# EAGLE design 2019_Dashboard(rev_1-15-19) (EAGLE 9.1.3)
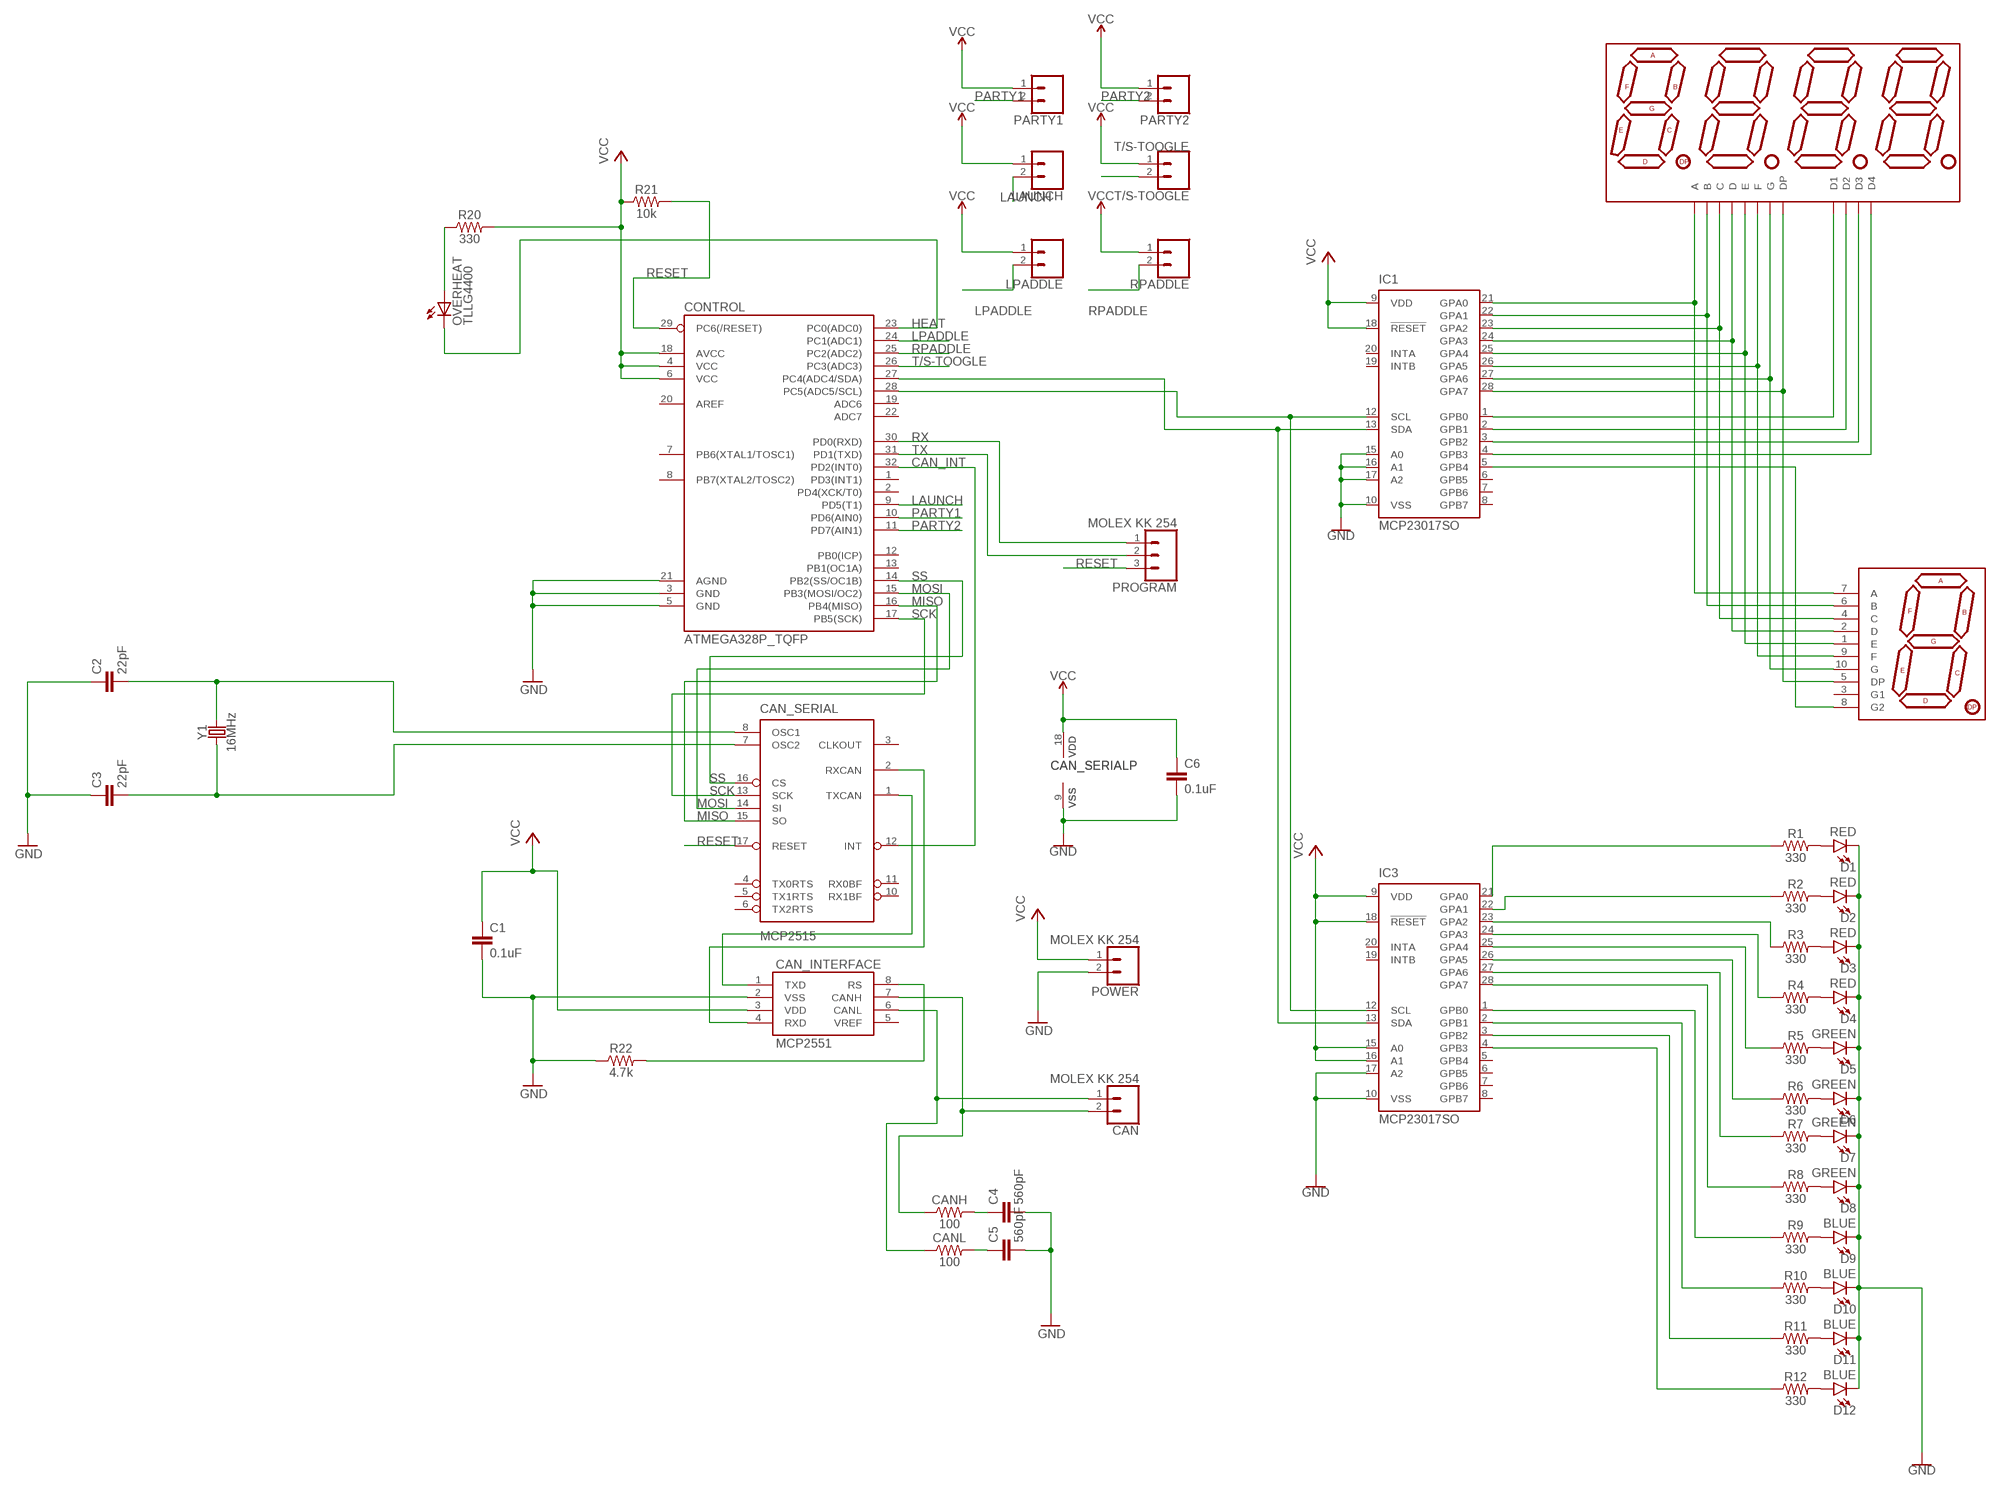
[diagram p0: schematic, sheet 1]

## Parts
C1  0.1uF  0.1UF-0603-25V-(+80/-20%)  [0603]
C2  22pF  22PF-0603-50V-5%  [0603]
C3  22pF  22PF-0603-50V-5%  [0603]
C4  560pF  560PF-0603-50V-5%  [0603]
C5  560pF  560PF-0603-50V-5%  [0603]
C6  0.1uF  0.1UF-0402-16V-10%  [0402]
CAN  MOLEX KK 254  CONN_02  [1X02]
CAN_INTERFACE  MCP2551  [SO08]
CAN_SERIAL  MCP2515  MCP2515(MCP2510)SO  [SO18W]
CANH  100  100OHM-0603-1/4W-5%  [0603]
CANL  100  100OHM-0603-1/4W-5%  [0603]
CONTROL  ATMEGA328P_TQFP  [TQFP32-08]
D1  RED  LED-RED1206  [LED-1206]
D2  RED  LED-RED1206  [LED-1206]
D3  RED  LED-RED1206  [LED-1206]
D4  RED  LED-RED1206  [LED-1206]
D5  GREEN  LED-GREENLILYPAD  [LED-1206]
D6  GREEN  LED-GREENLILYPAD  [LED-1206]
D7  GREEN  LED-GREENLILYPAD  [LED-1206]
D8  GREEN  LED-GREENLILYPAD  [LED-1206]
D9  BLUE  LED-BLUE1206  [LED-1206]
D10  BLUE  LED-BLUE1206  [LED-1206]
D11  BLUE  LED-BLUE1206  [LED-1206]
D12  BLUE  LED-BLUE1206  [LED-1206]
DISP1  ATA8041ARBJ  7-SEGMENT-4DIGIT-20MM-RED  [7-SEGMENT-4DIGIT-20MM]
IC1  MCP23017SO  [SO28W]
IC3  MCP23017SO  [SO28W]
LAUNCH  CONN_02LOCK  [1X02_LOCK]
LPADDLE  CONN_02LOCK  [1X02_LOCK]
OVERHEAT  TLLG4400  [LED3MM]
PARTY1  CONN_02LOCK  [1X02_LOCK]
PARTY2  CONN_02LOCK  [1X02_LOCK]
POWER  MOLEX KK 254  CONN_02  [1X02]
PROGRAM  MOLEX KK 254  CONN_03  [1X03]
R1  330  330OHM-0603-1/10W-1%  [0603]
R2  330  330OHM-0603-1/10W-1%  [0603]
R3  330  330OHM-0603-1/10W-1%  [0603]
R4  330  330OHM-0603-1/10W-1%  [0603]
R5  330  330OHM-0603-1/10W-1%  [0603]
R6  330  330OHM-0603-1/10W-1%  [0603]
R7  330  330OHM-0603-1/10W-1%  [0603]
R8  330  330OHM-0603-1/10W-1%  [0603]
R9  330  330OHM-0603-1/10W-1%  [0603]
R10  330  330OHM-0603-1/10W-1%  [0603]
R11  330  330OHM-0603-1/10W-1%  [0603]
R12  330  330OHM-0603-1/10W-1%  [0603]
R20  330  330OHM-0603-1/10W-1%  [0603]
R21  10k  10KOHM-0603-1/10W-1%  [0603]
R22  4.7k  4.7KOHM-0603-1/10W-1%  [0603]
RPADDLE  CONN_02LOCK  [1X02_LOCK]
T/S-TOOGLE  CONN_02LOCK  [1X02_LOCK]
U$1  YSD-1601AR4B-8  7-SEGMENT-1DIGIT-1INCH-RED  [7-SEGMENT-1"PTH]
Y1  16MHz  CRYSTAL-16MHZPTH-HC49US  [HC49US]

## Nets
CAN_INT: CAN_SERIAL.12(INT) CONTROL.32(PD2(INT0))
CANH: CAN.2 CAN_INTERFACE.7(CANH) CANH.1
CANL: CAN.1 CAN_INTERFACE.6(CANL) CANL.1
CHI: C4.1 CANH.2
CI_SLOPE: CAN_INTERFACE.8(RS) R22.2
CLI: C5.1 CANL.2
GND: C1.2 C2.1 C3.1 C4.2 C5.2 C6.2 CAN_INTERFACE.2(VSS) CAN_SERIAL.9(VSS) CONTROL.3(GND) CONTROL.5(GND) CONTROL.21(AGND) D1.C D2.C D3.C D4.C D5.C D6.C D7.C D8.C D9.C D10.C D11.C D12.C IC1.10(VSS) IC1.15(A0) IC1.16(A1) IC1.17(A2) IC3.10(VSS) IC3.17(A2) POWER.2 R22.1
HEAT: CONTROL.23(PC0(ADC0)) OVERHEAT.K(C)
HEAT+: OVERHEAT.A R20.1
LAUNCH: CONTROL.9(PD5(T1)) LAUNCH.2
LPADDLE: CONTROL.24(PC1(ADC1)) LPADDLE.2
MISO: CAN_SERIAL.15(SO) CONTROL.16(PB4(MISO))
MOSI: CAN_SERIAL.14(SI) CONTROL.15(PB3(MOSI/OC2))
N$1: CONTROL.28(PC5(ADC5/SCL)) IC1.12(SCL) IC3.12(SCL)
N$2: CONTROL.27(PC4(ADC4/SDA)) IC1.13(SDA) IC3.13(SDA)
N$3: DISP1.11(A) IC1.21(GPA0) U$1.7(A)
N$4: DISP1.7(B) IC1.22(GPA1) U$1.6(B)
N$5: DISP1.4(C) IC1.23(GPA2) U$1.4(C)
N$6: DISP1.2(D) IC1.24(GPA3) U$1.2(D)
N$7: DISP1.1(E) IC1.25(GPA4) U$1.1(E)
N$8: DISP1.10(F) IC1.26(GPA5) U$1.9(F)
N$9: DISP1.5(G) IC1.27(GPA6) U$1.10(G)
N$10: DISP1.3(DP) IC1.28(GPA7) U$1.5(DP)
N$11: DISP1.12(D1) IC1.1(GPB0)
N$12: DISP1.9(D2) IC1.2(GPB1)
N$13: DISP1.8(D3) IC1.3(GPB2)
N$14: DISP1.6(D4) IC1.4(GPB3)
N$15: IC1.5(GPB4) U$1.8(G2)
N$22: D1.A R1.2
N$23: D2.A R2.2
N$24: D3.A R3.2
N$25: D4.A R4.2
N$26: D5.A R5.2
N$27: D7.A R7.2
N$28: D8.A R8.2
N$29: D9.A R9.2
N$30: D10.A R10.2
N$31: D11.A R11.2
N$32: D12.A R12.2
N$33: D6.A R6.2
N$34: IC3.21(GPA0) R1.1
N$35: IC3.22(GPA1) R2.1
N$36: IC3.23(GPA2) R3.1
N$37: IC3.24(GPA3) R4.1
N$38: IC3.25(GPA4) R5.1
N$39: IC3.26(GPA5) R6.1
N$40: IC3.27(GPA6) R7.1
N$41: IC3.28(GPA7) R8.1
N$42: IC3.1(GPB0) R9.1
N$43: IC3.2(GPB1) R10.1
N$44: IC3.3(GPB2) R11.1
N$45: IC3.4(GPB3) R12.1
N$57: CAN_INTERFACE.1(TXD) CAN_SERIAL.1(TXCAN)
N$58: CAN_INTERFACE.4(RXD) CAN_SERIAL.2(RXCAN)
OSC1: C2.2 CAN_SERIAL.8(OSC1) Y1.2
OSC2: C3.2 CAN_SERIAL.7(OSC2) Y1.1
PARTY1: CONTROL.10(PD6(AIN0)) PARTY1.2
PARTY2: CONTROL.11(PD7(AIN1)) PARTY2.2
RESET: CAN_SERIAL.17(RESET) CONTROL.29(PC6(/RESET)) PROGRAM.3 R21.2
RPADDLE: CONTROL.25(PC2(ADC2)) RPADDLE.2
RX: CONTROL.30(PD0(RXD)) PROGRAM.1
SCK: CAN_SERIAL.13(SCK) CONTROL.17(PB5(SCK))
SS: CAN_SERIAL.16(CS) CONTROL.14(PB2(SS/OC1B))
T/S-TOOGLE: CONTROL.26(PC3(ADC3)) T/S-TOOGLE.2
TX: CONTROL.31(PD1(TXD)) PROGRAM.2
VCC: C1.1 C6.1 CAN_INTERFACE.3(VDD) CAN_SERIAL.18(VDD) CONTROL.4(VCC) CONTROL.6(VCC) CONTROL.18(AVCC) IC1.9(VDD) IC1.18(!RESET) IC3.9(VDD) IC3.15(A0) IC3.16(A1) IC3.18(!RESET) LAUNCH.1 LPADDLE.1 PARTY1.1 PARTY2.1 POWER.1 R20.2 R21.1 RPADDLE.1 T/S-TOOGLE.1
Unconnected: CAN_INTERFACE.5(VREF) CAN_SERIAL.3(CLKOUT) CAN_SERIAL.4(TX0RTS) CAN_SERIAL.5(TX1RTS) CAN_SERIAL.6(TX2RTS) CAN_SERIAL.10(RX1BF) CAN_SERIAL.11(RX0BF) CONTROL.1(PD3(INT1)) CONTROL.2(PD4(XCK/T0)) CONTROL.7(PB6(XTAL1/TOSC1)) CONTROL.8(PB7(XTAL2/TOSC2)) CONTROL.12(PB0(ICP)) CONTROL.13(PB1(OC1A)) CONTROL.19(ADC6) CONTROL.20(AREF) CONTROL.22(ADC7) IC1.6(GPB5) IC1.7(GPB6) IC1.8(GPB7) IC1.19(INTB) IC1.20(INTA) IC3.5(GPB4) IC3.6(GPB5) IC3.7(GPB6) IC3.8(GPB7) IC3.19(INTB) IC3.20(INTA) U$1.3(G1)

## Library data of the parts
C1 = SparkFun-Capacitors:0.1UF: 0.1µF ceramic capacitors A capacitor is a passive two-terminal electrical component used to store electrical energy temporarily in an electric field.; PROD_ID: CAP-00810
C2 C3 = SparkFun-Capacitors:22PF: 22pF ceramic capacitors A capacitor is a passive two-terminal electrical component used to store electrical energy temporarily in an electric field.; PROD_ID: CAP-07876
C4 C5 = SparkFun-Capacitors:560PF: 0.56nF/560pF ceramic capacitors A capacitor is a passive two-terminal electrical component used to store electrical energy temporarily in an electric field.; PROD_ID: CAP-08749
C6 = SparkFun-Capacitors:0.1UF: 0.1µF ceramic capacitors A capacitor is a passive two-terminal electrical component used to store electrical energy temporarily in an electric field.; PROD_ID: CAP-12416
CAN LAUNCH LPADDLE PARTY1 PARTY2 POWER RPADDLE T/S-TOOGLE = SparkFun-Connectors:CONN_02: Multi connection point. Often used as Generic Header-pin footprint for 0.1 inch spaced/style header connections On any of the 0.1 inch spaced packages, you can populate with these: Break Away Headers - Straight <https://www.sparkfun.com/products/116> (PRT-00116) Break Away Male Headers - Right Angle <https://www.sparkfun.com/products/553> (PRT-00553) Female Headers <https://www.sparkfun.com/products/115> (PRT-00115) Break Away Headers - Machine Pin <https://www.sparkfun.com/products/117> (PRT-00117) Break Away Female Headers - Swiss Machine Pin <https://www.sparkfun.com/products/743> (PRT-00743) For SCREWTERMINALS and SPRING TERMINALS visit here: Screw Terimnals on SparkFun.com <https://www.sparkfun.com/search/results?term=Screw+Terminals> (5mm/3.5mm/2.54mm spacing) This device is also useful as a general connection point to wire up your design to another part of your project. Our various solder wires solder well into these plated through hole pads. Hook-Up Wire - Assortment (Stranded, 22 AWG) <https://www.sparkfun.com/products/11375> (PRT-11375) Hook-Up Wire - Assortment (Solid Core, 22 AWG) <https://www.sparkfun.com/products/11367> (PRT-11367) View the entire wire category on our website here <https://www.sparkfun.com/categories/141> Special notes: Molex polarized connector foot print use with: PRT-08233 with associated crimp pins and housings. 2.54_SCREWTERM for use with PRT-10571. 3.5mm Screw Terminal footprints for PRT-08084 5mm Screw Terminal footprints for use with PRT-08432
CAN_INTERFACE = SparkFun-IC-Comms:MCP2551: MCP2551 High Speed CAN Transceiver High speed CAN transceiver Datasheet <http://www.sparkfun.com/datasheets/DevTools/Arduino/MCP2551.pdf> SparkFun Products CAN-BUS Shield <https://www.sparkfun.com/products/13262> (DEV-13262) SparkFun OBD-II UART <https://www.sparkfun.com/products/9555> (WIG-09555); PROD_ID: IC-09907
CAN_SERIAL = SparkFun-IC-Comms:MCP2515(MCP2510): CAN controller with SPI interface The MCP2515 controller supercedes the MCP2510 while addressing all errata associated with it. The two devices are pin compatible, either can be used with this device. 18-pin package SOIC Simple SPI interface to any MCU. One-shot mode ensures message transmission is attempted only once Databyte filtering Start-of-Frame (SOF) output Low-power CMOS Technology Datasheet <http://www.sparkfun.com/datasheets/DevTools/Arduino/MCP2515.pdf> SparkFun Products CAN-BUS Shield <https://www.sparkfun.com/products/13262> (DEV-13262); PROD_ID: IC-09906
CANH CANL = SparkFun-Resistors:100OHM: 100Ω resistor A resistor is a passive two-terminal electrical component that implements electrical resistance as a circuit element. Resistors act to reduce current flow, and, at the same time, act to lower voltage levels within circuits. - Wikipedia; PROD_ID: RES-12438
CONTROL = SparkFun-IC-Microcontroller:ATMEGA328P_TQFP: Popular 328P in QFP Storefront component: ATmega328 - TQFP <https://www.sparkfun.com/products/13448> (COM-13448) Datasheet <http://www.sparkfun.com/datasheets/Components/SMD/ATMega328.pdf> SparkFun Products SparkFun RedBoard - Programmed with Arduino <https://www.sparkfun.com/products/12757> (DEV-12757) Arduino Pro Mini 328 - 5V/16MHz <https://www.sparkfun.com/products/11113> (DEV-11113) Arduino Pro Mini 328 - 3.3V/8MHz <https://www.sparkfun.com/products/11114> (DEV-11114) SparkFun OpenLog <https://www.sparkfun.com/products/13712> (DEV-13712) SparkFun MicroView - OLED Arduino Module <https://www.sparkfun.com/products/12923> (DEV-12923) SparkFun Digital Sandbox <https://www.sparkfun.com/products/12651> (DEV-12651) SparkFun PicoBoard <https://www.sparkfun.com/products/11888> (WIG-11888) Arduino Fio <https://www.sparkfun.com/products/10116> (DEV-10116) LilyPad Arduino 328 Main Board <https://www.sparkfun.com/products/13342> (DEV-13342) SparkFun RedStick <https://www.sparkfun.com/products/13741> (DEV-13741) LilyPad MP3 <https://www.sparkfun.com/products/11013> (DEV-11013) LilyPad Arduino SimpleSnap <https://www.sparkfun.com/products/10941> (DEV-10941) SparkFun Stepoko <https://www.sparkfun.com/products/13899> (ROB-13899) SparkFun Geiger Counter <https://www.sparkfun.com/products/11345> (SEN-11345) SparkFun EL Sequencer <https://www.sparkfun.com/products/12781> (COM-12781) Arduino Pro 328 - 5V/16MHz <https://www.sparkfun.com/products/10915> (DEV-10915) CryptoCape <https://www.sparkfun.com/products/12773> (DEV-12773) SparkFun IR Thermometer Evaluation Board - MLX90614 <https://www.sparkfun.com/products/10740> (SEN-10740) SparkFun RedBot Mainboard <https://www.sparkfun.com/products/12097> (ROB-12097) Arduino Pro 328 - 3.3V/8MHz <https://www.sparkfun.com/products/10914> (DEV-10914) SparkFun Block for Intel® Edison - Arduino <https://www.sparkfun.com/products/13036> (DEV-13036) SparkFun Simon Says - Surface Mount Soldering Kit <https://www.sparkfun.com/products/10935> (KIT-10935) SparkFun 7-Segment Serial Display - Red <https://www.sparkfun.com/products/11441> (COM-11441) SparkFun 7-Segment Serial Display - White <https://www.sparkfun.com/products/11629> (COM-11629) SparkFun 7-Segment Serial Display - Yellow <https://www.sparkfun.com/products/11443> (COM-11443) SparkFun 7-Segment Serial Display - Kelly Green <https://www.sparkfun.com/products/11440> (COM-11440) SparkFun 7-Segment Serial Display - Blue <https://www.sparkfun.com/products/11442> (COM-11442) SparkFun OpenSegment Serial Display - 20mm (Blue) <https://www.sparkfun.com/products/11647> (COM-11647) SparkFun OpenSegment Serial Display - 20mm (Green) <https://www.sparkfun.com/products/11646> (COM-11646) SparkFun OpenSegment Serial Display - 20mm (White) <https://www.sparkfun.com/products/11648> (COM-11648) SparkFun OpenSegment Serial Display - 20mm (Red) <https://www.sparkfun.com/products/11644> (COM-11644) SparkFun OpenSegment Serial Display - 20mm (Yellow) <https://www.sparkfun.com/products/11645> (COM-11645) SparkFun OpenSegment Shield <https://www.sparkfun.com/products/13190> (DEV-13190); PROD_ID: IC-09069
D1-D4 = SparkFun-LED:LED-RED: Red SMD LED Used in manufacturing of most products at SparkFun Packages: 0603 - SMD 0603 package [Product Link] <http://docs.avagotech.com/docs/AV02-0551EN> 0603 SMART - SMD 0603 SMART package ( more efficient and expensive)[Product Link] <http://www.osram-os.com/Graphics/XPic2/00077099_0.pdf> 1206 - SMD1206 package [Product Link] <https://www.sparkfun.com/datasheets/DevTools/LilyPad/Q150OVS4.pdff> SparkFun Products: Pro Mini 328 -5V <https://www.sparkfun.com/products/821> RedBoard <https://www.sparkfun.com/products/12757> IOIO-OTG <https://www.sparkfun.com/products/13613>; PROD_ID: DIO-09912
D5-D8 = SparkFun-LED:LED-GREEN: Green SMD LED Used in manufacturing of various products at SparkFun Packages: 0603 - SMD 0603 package [Product Link] <http://www.futureelectronics.com/en/technologies/semiconductors/optoelectronics/leds/Pages/9894312-LTST-C190GKT.aspx?CrossPart=HSMG-C190&IM=0> LilyPad 1206 - SMD1206 LilyPad package [Product Link] <http://www.futureelectronics.com/en/Technologies/Product.aspx?ProductID=IN150NGHARVATEKCORPORATION2049943&IM=0> 1206 - SMD1206 package [Product Link] <http://www.futureelectronics.com/en/technologies/semiconductors/optoelectronics/leds/Pages/8315665-LTST-C150KGKT.aspx?IM=0> 1206 Bottom Mount -SMD 1206 Bottom Mount [Product Link] <http://www.digikey.com/product-detail/en/lite-on-inc/LTST-C230KGKT/160-1456-1-ND/386854> SparkFun Products: Pro Mini 328 -5V <https://www.sparkfun.com/products/821> RedBoard <https://www.sparkfun.com/products/12757> MP3 Trigger <https://www.sparkfun.com/products/13720> Makey Makey <https://www.sparkfun.com/products/11076>; PROD_ID: DIO-09910
D9-D12 = SparkFun-LED:LED-BLUE: Blue SMD LED Used in manufacturing of various products at SparkFun Packages: 0603 - SMD 0603 package [Product Link] <http://www.digikey.com/product-detail/en/SMLE12BC7TT86/511-1589-2-ND/1641808> 1206 - SMD1206 package [Product Link] <http://www.digikey.com/product-detail/en/lite-on-inc/LTST-C150TBKT/160-1643-1-ND/573584> SparkFun Products: ESP8266 Thing-Dev Board <https://www.sparkfun.com/products/13711> RedBoard <https://www.sparkfun.com/products/12757>; PROD_ID: DIO-09911
DISP1 = SparkFun-LED:7-SEGMENT-4DIGIT-20MM: 4 Digit 7 Segment Display This is a part for the 4-Digit 7-segment LEDs from Young Sun. Different from the Digikey LEDs, all 16 pins are used. The LONGPADS Variant is used for a test jig, but you may like it because there is more pad to solder to. If you are concerned about routing space, the standard works just fine though. Datasheets: Red <http://cdn.sparkfun.com/datasheets/Components/LED/1LEDREDCC.pdf> Yellow <http://cdn.sparkfun.com/datasheets/Components/LED/1LEDYELCC.pdf> Green <http://cdn.sparkfun.com/datasheets/Components/LED/1LEDGRNCC.pdf> Blue <http://cdn.sparkfun.com/datasheets/Components/LED/1LEDBLUCC.pdf> White <http://cdn.sparkfun.com/datasheets/Components/LED/1LEDWHTCC.pdf> SparkFun Products Raw Components 7-Segment Display - 20mm (Red) <https://www.sparkfun.com/products/11405> (COM-11405) 7-Segment Display - 20mm (Yellow) <https://www.sparkfun.com/products/11406> (COM-11406) 7-Segment Display - 20mm (Green) <https://www.sparkfun.com/products/11407> (COM-11407) 7-Segment Display - 20mm (Blue) <https://www.sparkfun.com/products/11408> (COM-11408) 7-Segment Display - 20mm (White) <https://www.sparkfun.com/products/11409> (COM-11409) Serial Controlled SparkFun OpenSegment Serial Display - 20mm (Red) <https://www.sparkfun.com/products/11644> (COM-11644) SparkFun OpenSegment Serial Display - 20mm (Yellow) <https://www.sparkfun.com/products/11645> (COM-11645) SparkFun OpenSegment Serial Display - 20mm (Green) <https://www.sparkfun.com/products/11646> (COM-11646) SparkFun OpenSegment Serial Display - 20mm (Blue) <https://www.sparkfun.com/products/11647> (COM-11647) SparkFun OpenSegment Serial Display - 20mm (White) <https://www.sparkfun.com/products/11648> (COM-11648) Other SparkFun OpenSegment Shield <https://www.sparkfun.com/products/13190> (DEV-13190); PROD_ID: COMP-11449
IC1 IC3 = adafruit:MCP23017: http://ww1.microchip.com/downloads/en/DeviceDoc/21952a.pdf Source: http://ww1.microchip.com/downloads/en/DeviceDoc/21952a.pdf
OVERHEAT = led:TLLG4400: Low Current (2mA) LED 3 mm Tinted Diffused Package color GREEN Source: Data sheet <http://www.farnell.com/datasheets/391098.pdf>; MF: VISHAY SEMICONDUCTOR; OC_FARNELL: 1612435
PROGRAM = SparkFun-Connectors:CONN_03: Multi connection point. Often used as Generic Header-pin footprint for 0.1 inch spaced/style header connections On any of the 0.1 inch spaced packages, you can populate with these: Break Away Headers - Straight <https://www.sparkfun.com/products/116> (PRT-00116) Break Away Male Headers - Right Angle <https://www.sparkfun.com/products/553> (PRT-00553) Female Headers <https://www.sparkfun.com/products/115> (PRT-00115) Break Away Headers - Machine Pin <https://www.sparkfun.com/products/117> (PRT-00117) Break Away Female Headers - Swiss Machine Pin <https://www.sparkfun.com/products/743> (PRT-00743) Stackable Header - 3 Pin (Female, 0.1") <https://www.sparkfun.com/products/13875> (PRT-13875) For SCREWTERMINALS and SPRING TERMINALS visit here: Screw Terimnals on SparkFun.com <https://www.sparkfun.com/search/results?term=Screw+Terminals> (5mm/3.5mm/2.54mm spacing) This device is also useful as a general connection point to wire up your design to another part of your project. Our various solder wires solder well into these plated through hole pads. Hook-Up Wire - Assortment (Stranded, 22 AWG) <https://www.sparkfun.com/products/11375> (PRT-11375) Hook-Up Wire - Assortment (Solid Core, 22 AWG) <https://www.sparkfun.com/products/11367> (PRT-11367) View the entire wire category on our website here <https://www.sparkfun.com/categories/141> Special notes: Molex polarized connector foot print use with SKU : PRT-08232 with associated crimp pins and housings.
R1-R12 R20 = SparkFun-Resistors:330OHM: 330Ω resistor A resistor is a passive two-terminal electrical component that implements electrical resistance as a circuit element. Resistors act to reduce current flow, and, at the same time, act to lower voltage levels within circuits. - Wikipedia; PROD_ID: RES-00818
R21 = SparkFun-Resistors:10KOHM: 10kΩ resistor A resistor is a passive two-terminal electrical component that implements electrical resistance as a circuit element. Resistors act to reduce current flow, and, at the same time, act to lower voltage levels within circuits. - Wikipedia; PROD_ID: RES-00824
R22 = SparkFun-Resistors:4.7KOHM: 4.7kΩ resistor A resistor is a passive two-terminal electrical component that implements electrical resistance as a circuit element. Resistors act to reduce current flow, and, at the same time, act to lower voltage levels within circuits. - Wikipedia; PROD_ID: RES-07857
U$1 = SparkFun-LED:7-SEGMENT-1DIGIT-1INCH: 7-Segment Display, single digit, 1" EZ is for kits. Pads are only exposed on the bottom side to help prevent soldering in upside down. Datasheet (Red) <https://cdn.sparkfun.com/datasheets/Components/LED/YSD-160AR4B-8.pdf> Datasheet (Blue) <https://cdn.sparkfun.com/datasheets/Components/LED/YSD-160AB3C-8.pdf> SparkFun Products 7-Segment Display - LED (Red) <https://www.sparkfun.com/products/8546> (COM-08546) 7-Segment Display - LED (Blue) <https://www.sparkfun.com/products/9191> (COM-09191); PROD_ID: COMP-08615
Y1 = SparkFun-Clocks:CRYSTAL-16MHZ: 16MHz Crystal Digikey Example <http://www.digikey.com/product-search/en?keywords=535-9122-1-ND> Frequency: 16MHz Frequency Stability: ±50ppm Frequency Tolerance: ±20ppm Load Capacitance: 18pF SparkFun Products: Pro Micro -5V/16MHz <https://www.sparkfun.com/products/12640> SparkFun Serial Enabled LCD Kit <https://www.sparkfun.com/products/10097>; PROD_ID: XTAL-08181; SF_ID: COM-00536

## Board
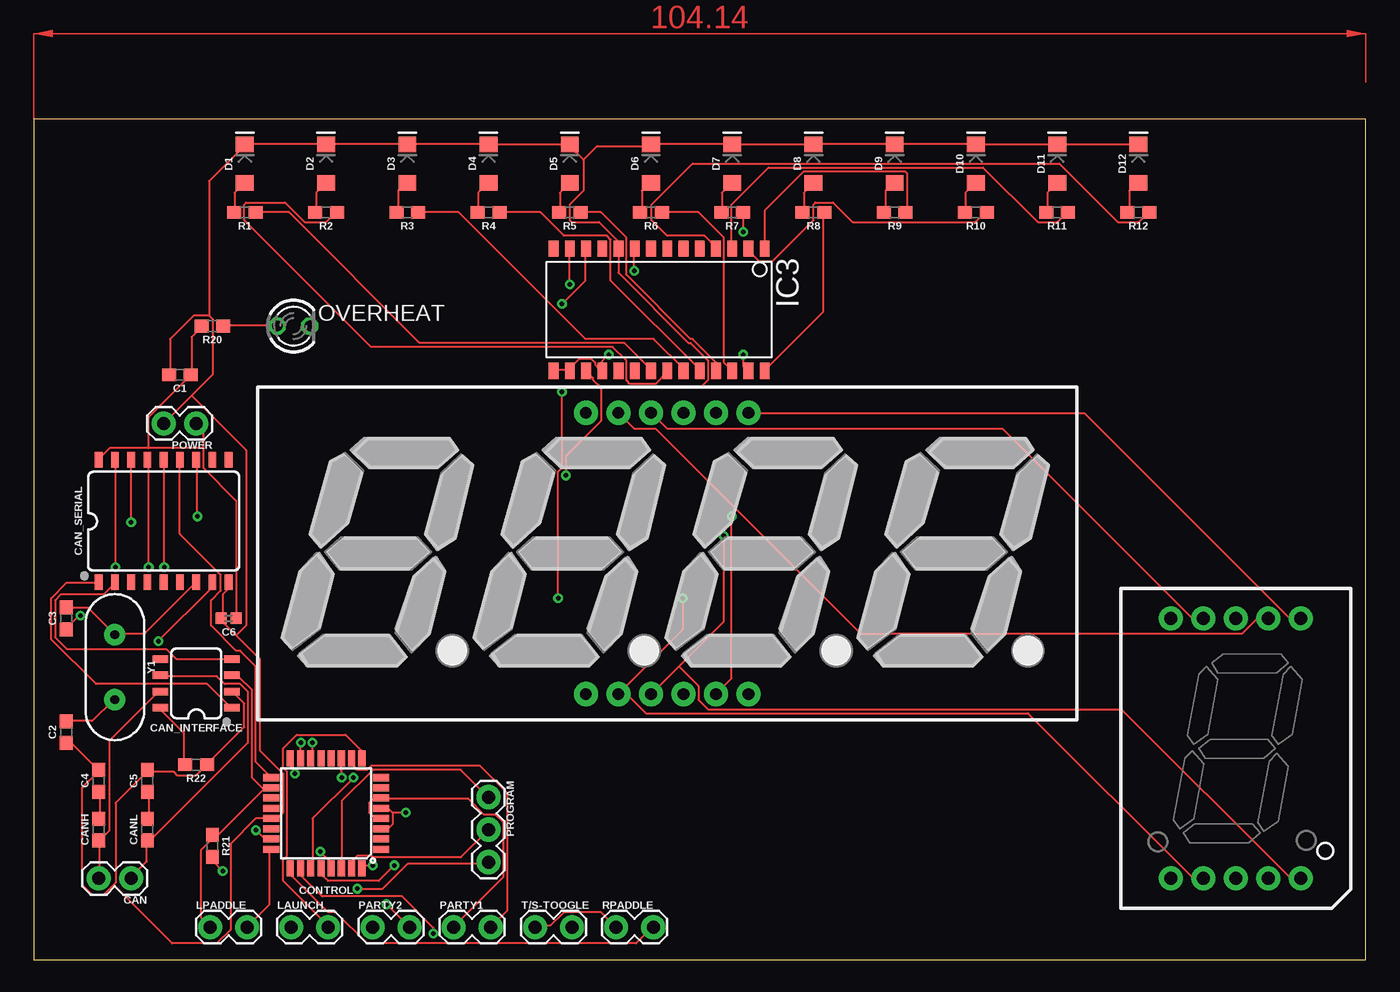
[diagram p1: board, top side]
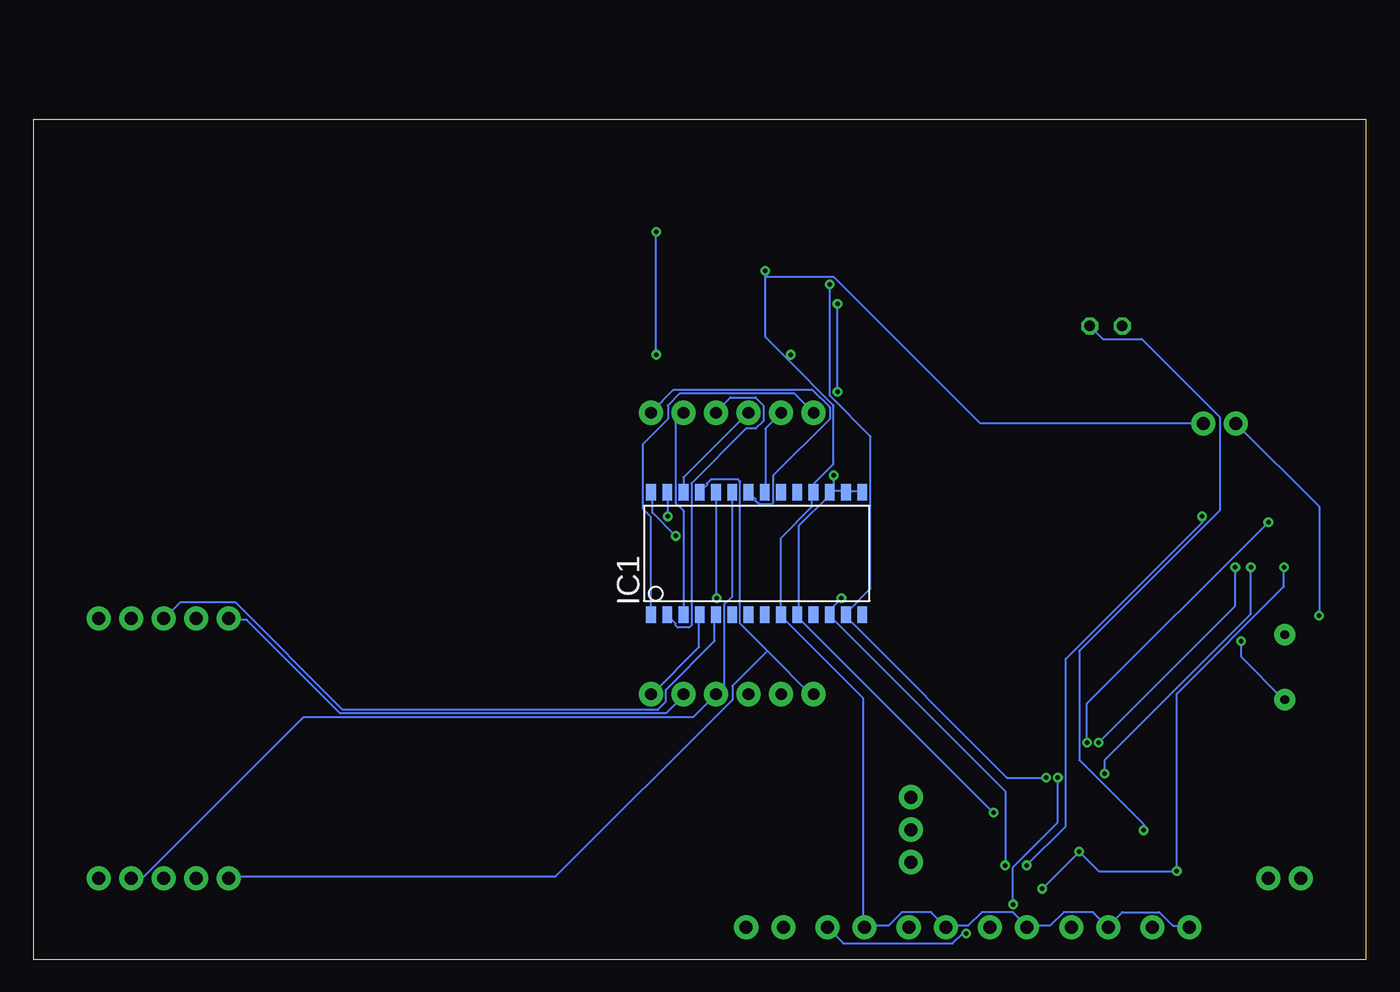
[diagram p2: board, bottom side, seen from below]

Size 104.12 x 65.71 mm. Coordinates in mm from the lower left corner, seen from the top.
Outline: 0,0 104.12,0 104.12,65.71 0,65.71 0,0
Copper layers (1*16): Top 0.035mm / dielectric 1.5mm / Bottom 0.035mm
Design rules "default": minimum track width 6mil, minimum drill 0.35mm, track to track 6mil, track to pad 6mil, pad to pad 6mil, via to via 6mil, smd to smd 6mil, copper to edge 40mil, drill to drill 6mil, minimum pad ring 10mil, minimum via ring 8mil, stop-mask expansion 4mil, vias tented up to drill 0mil, thermal gap 10mil

### Footprints (pad centres in the part's own frame; a part is rotated, then mirrored left to right if it is on the bottom)
0603 = smd 1.1 x 1: 1 -0.85,0; 2 0.85,0
0402 = smd 0.85 x 0.9: 1 -0.58,0; 2 0.58,0
1X02 = drill 1.016 pad 1.88: 1 0,0; 2 2.54,0
SO08 = smd 0.6 x 1.2: 1 -1.905,-2.8; 2 -0.635,-2.8; 3 0.635,-2.8; 4 1.905,-2.8; 5 1.905,2.8; 6 0.635,2.8; 7 -0.635,2.8; 8 -1.905,2.8
SO18W = smd 0.6 x 1.2: 1 -5.08,-4.788; 2 -3.81,-4.788; 3 -2.54,-4.788; 4 -1.27,-4.788; 5 0,-4.788; 6 1.27,-4.788; 7 2.54,-4.788; 8 3.81,-4.788; 9 5.08,-4.788; 10 5.08,4.788; 11 3.81,4.788; 12 2.54,4.788; 13 1.27,4.788; 14 0,4.788; 15 -1.27,4.788; 16 -2.54,4.788; 17 -3.81,4.788; 18 -5.08,4.788
TQFP32-08 = smd 1.27 x 0.559: 1 -4.293,2.8; 2 -4.293,2; 3 -4.293,1.2; 4 -4.293,0.4; 5 -4.293,-0.4; 6 -4.293,-1.2; 7 -4.293,-2; 8 -4.293,-2.8; 17 4.293,-2.8; 18 4.293,-2; 19 4.293,-1.2; 20 4.293,-0.4; 21 4.293,0.4; 22 4.293,1.2; 23 4.293,2; 24 4.293,2.8 | smd 0.559 x 1.27: 9 -2.8,-4.293; 10 -2,-4.293; 11 -1.2,-4.293; 12 -0.4,-4.293; 13 0.4,-4.293; 14 1.2,-4.293; 15 2,-4.293; 16 2.8,-4.293; 25 2.8,4.293; 26 2,4.293; 27 1.2,4.293; 28 0.4,4.293; 29 -0.4,4.293; 30 -1.2,4.293; 31 -2,4.293; 32 -2.8,4.293
LED-1206 = smd 1.2 x 1.4: A -1.5,0; C 1.5,0
7-SEGMENT-4DIGIT-20MM = drill 0.9 pad 1.88: 1 -6.35,-10.998; 2 -3.81,-10.998; 3 -1.27,-10.998; 4 1.27,-10.998; 5 3.81,-10.998; 6 6.35,-10.998; 7 6.35,10.998; 8 3.81,10.998; 9 1.27,10.998; 10 -1.27,10.998; 11 -3.81,10.998; 12 -6.35,10.998
SO28W = smd 0.762 x 1.27: 1 -7.62,-4.78; 2 -6.35,-4.78; 3 -5.08,-4.78; 4 -3.81,-4.78; 5 -2.54,-4.78; 6 -1.27,-4.78; 7 0,-4.78; 8 1.27,-4.78; 9 2.54,-4.78; 10 3.81,-4.78; 11 5.08,-4.78; 12 6.35,-4.78; 13 7.62,-4.78; 14 8.89,-4.78; 15 8.89,4.78; 16 7.62,4.78; 17 6.35,4.78; 18 5.08,4.78; 19 3.81,4.78; 20 2.54,4.78; 21 1.27,4.78; 22 0,4.78; 23 -1.27,4.78; 24 -2.54,4.78; 25 -3.81,4.78; 26 -5.08,4.78; 27 -6.35,4.78; 28 -7.62,4.78
1X02_LOCK = drill 1.016 pad 1.88: 1 -0.178,0; 2 2.718,0
LED3MM = drill 0.813 octagon: A -1.27,0; K 1.27,0
1X03 = drill 1.016 pad 1.88: 1 0,0; 2 2.54,0; 3 5.08,0
7-SEGMENT-1"PTH = drill 1 pad 1.88: 1 -5.08,-10.16; 2 -2.54,-10.16; 3 0,-10.16; 4 2.54,-10.16; 5 5.08,-10.16; 6 5.08,10.16; 7 2.54,10.16; 8 0,10.16; 9 -2.54,10.16; 10 -5.08,10.16
HC49US = drill 0.7 pad 1.651: 1 -2.54,0; 2 2.54,0

### Placement (x,y rotation side)
C1  11.43,45.72 180 top
C2  2.54,17.78 90 top
C3  2.54,26.67 90 top
C4  5.08,13.97 90 top
C5  8.89,13.97 90 top
C6  15.24,26.67 180 top
CAN  7.62,6.35 180 top
CAN_INTERFACE  12.7,21.59 90 top
CAN_SERIAL  10.16,34.29 0 top
CANH  5.08,10.16 90 top
CANL  8.89,10.16 90 top
CONTROL  22.86,11.43 180 top
D1  16.51,62.23 90 top
D2  22.86,62.23 90 top
D3  29.21,62.23 90 top
D4  35.56,62.23 90 top
D5  41.91,62.23 90 top
D6  48.26,62.23 90 top
D7  54.61,62.23 90 top
D8  60.96,62.23 90 top
D9  67.31,62.23 90 top
D10  73.66,62.23 90 top
D11  80.01,62.23 90 top
D12  86.36,62.23 90 top
DISP1  49.53,31.75 0 top
IC1  48.26,31.75 0 bottom
IC3  49.53,50.8 180 top
LAUNCH  20.32,2.54 0 top
LPADDLE  13.97,2.54 0 top
OVERHEAT  20.32,49.53 0 top
PARTY1  33.02,2.54 0 top
PARTY2  26.67,2.54 0 top
POWER  12.7,41.91 180 top
PROGRAM  35.56,12.7 270 top
R1  16.51,58.42 180 top
R2  22.86,58.42 180 top
R3  29.21,58.42 180 top
R4  35.56,58.42 180 top
R5  41.91,58.42 180 top
R6  48.26,58.42 180 top
R7  54.61,58.42 180 top
R8  60.96,58.42 180 top
R9  67.31,58.42 180 top
R10  73.66,58.42 180 top
R11  80.01,58.42 180 top
R12  86.36,58.42 180 top
R20  13.97,49.53 180 top
R21  13.97,8.89 270 top
R22  12.7,15.24 180 top
RPADDLE  45.72,2.54 0 top
T/S-TOOGLE  39.37,2.54 0 top
U$1  93.98,16.51 0 top
Y1  6.35,22.86 270 top

### Tracks (layer width: path | path; a pad name or v marks a point on that pad's centre or on a via)
CAN_INT  (via drill 0.35)
  Top 0.152: v12.8,34.65 12.8,39.06 CAN_SERIAL.12 | v26.52,7.37 25.91,7.37 25.76,7.21 CONTROL.32
  Bottom 0.152: v12.8,34.65 12.8,34.19 23.47,23.52 23.47,10.41 v26.52,7.37
CANH
  Top 0.152: CAN.2 5.18,6.45 5.18,9.2 CANH.1 5.18,9.35 5.94,10.11 5.94,17.12 9.75,20.93 CAN_INTERFACE.7
CANL
  Top 0.152: CAN.1 7.62,6.45 8.84,7.67 8.84,9.2 CANL.1 8.99,9.2 16.76,16.97 16.76,20.93 16.15,21.54 14.93,21.54 14.33,22.15 9.91,22.15 CAN_INTERFACE.6
CHI
  Top 0.152: CANH.2 5.18,11.02 5.18,13 C4.1
CI_SLOPE
  Top 0.152: R22.2 11.73,15.29 11.73,17.73 9.91,19.56 CAN_INTERFACE.8
CLI
  Top 0.152: CANL.2 8.99,11.02 8.99,13 C5.1
GND  (via drill 0.35)
  Top 0.152: C2.1 2.59,16.82 3.05,16.82 5.03,14.83 C4.2 5.03,14.68 3.81,13.46 3.81,5.84 4.57,5.08 5.49,5.08 6.25,5.84 | CAN_INTERFACE.2 15.55,20.93 16.46,20.01 16.46,18.19 13.56,15.29 R22.1 13.41,15.14 12.65,14.38 11.28,14.38 10.97,14.68 8.99,14.68 C5.2 8.84,14.68 6.4,12.24 6.4,5.99 6.25,5.84 | CAN_SERIAL.9 15.24,29.01 14.78,28.55 14.78,26.72 C6.2 14.63,26.57 15.85,25.35 | 15.85,25.35 17.68,23.52 17.68,16.36 19.51,14.53 19.51,11.48 19.2,11.18 18.59,11.18 CONTROL.21 18.44,11.02 17.37,11.02 15.39,9.04 15.39,2.34 14.33,1.27 10.82,1.27 6.25,5.84 | v3.66,26.87 3.5,26.87 2.59,25.96 C3.1 | 13.72,50.34 12.5,50.34 10.67,48.51 10.67,45.77 C1.2 | 13.72,50.34 14.02,50.04 14.02,45.77 12.34,44.09 | POWER.2 12.34,44.09 | 15.85,25.35 16.61,26.11 16.61,39.83 12.34,44.09 | 28.04,11.48 28.04,10.57 27.74,10.26 27.28,10.26 CONTROL.3 | 28.04,11.48 27.74,11.79 27.28,11.79 CONTROL.5 | v29.11,11.48 28.04,11.48 | 60.96,63.75 54.71,63.75 D7.C 54.56,63.75 48.31,63.75 D6.C 48.16,63.6 44.04,63.6 42.98,62.53 | 80.01,63.75 73.76,63.75 D10.C 73.61,63.75 67.36,63.75 D9.C 67.21,63.75 60.96,63.75 | 80.01,63.75 86.26,63.75 D12.C | 80.01,63.75 D11.C | 60.96,63.75 D8.C | 44.35,44.7 43.74,45.31 43.74,45.47 43.28,45.92 IC3.17 | 44.35,44.7 52.12,44.7 52.73,45.31 52.73,46.84 51.36,48.21 51.21,48.21 45.72,53.7 IC3.10 45.72,56.13 44.2,57.66 42.06,57.66 41.91,57.81 41.91,59.03 42.98,60.1 42.98,62.53 | 22.86,63.75 16.61,63.75 D1.C 16.46,63.6 13.72,60.86 13.72,50.34 | 22.86,63.75 29.11,63.75 D3.C 29.26,63.75 35.51,63.75 D4.C 35.66,63.75 41.91,63.75 D5.C 41.91,63.6 42.98,62.53 | 22.86,63.75 D2.C | v41.6,37.85 41.6,39.37 44.35,42.11 44.35,44.7
  Bottom 0.152: v3.66,26.87 3.66,35.41 POWER.2 | IC1.15 39.47,36.63 40.54,36.63 IC1.16 40.69,36.63 41.6,36.63 | 41.6,36.63 41.91,36.63 IC1.17 | IC1.17 41.91,36.32 44.35,33.88 44.35,27.03 IC1.10 44.5,26.87 v29.11,11.48 | v41.6,37.85 41.6,36.63 | 41.6,36.63 IC1.17
HEAT  (via drill 0.35)
  Top 0.152: v17.37,10.11 17.98,9.5 18.44,9.5 CONTROL.23
  Bottom 0.152: v17.37,10.11 17.37,10.57 22.4,15.6 22.4,24.13 11.43,35.1 11.43,42.42 17.53,48.51 20.57,48.51 OVERHEAT.K
HEAT+
  Top 0.152: R20.1 14.93,49.58 19.05,49.58 OVERHEAT.A
LAUNCH
  Top 0.152: CONTROL.9 25.6,15.75 25.6,16.36 24.38,17.58 20.57,17.58 19.51,16.51 19.51,14.99 19.81,14.68 19.81,8.13 19.51,7.82 19.51,6.15 23.01,2.64 LAUNCH.2
LPADDLE
  Top 0.152: CONTROL.24 18.44,8.59 18.44,4.32 16.76,2.64 LPADDLE.2
MISO  (via drill 0.35)
  Top 0.152: v8.99,30.68 8.99,39.06 CAN_SERIAL.15 | v20.42,14.53 20.42,14.83 20.12,15.14 20.12,15.6 CONTROL.16
  Bottom 0.152: v8.99,30.68 8.99,27.03 20.42,15.6 v20.42,14.53
MOSI  (via drill 0.35)
  Top 0.152: v10.21,30.68 10.21,39.06 CAN_SERIAL.14 | v20.88,16.97 20.88,15.75 CONTROL.15
  Bottom 0.152: v10.21,30.68 10.21,27.64 v20.88,16.97
N$1  (via drill 0.35)
  Top 0.152: v28.19,7.37 26.98,6.15 23.01,6.15 22.55,6.6 22.55,7.06 CONTROL.28 | v41.3,51.26 43.13,53.09 43.13,55.52 IC3.12 | v41.3,44.4 41.3,38.46 41,38.15 v41,28.25
  Bottom 0.152: v28.19,7.37 28.19,13.16 41.91,26.87 IC1.12 41.91,27.33 v41,28.25 | v41.3,44.4 v41.3,51.26
N$2  (via drill 0.35)
  Top 0.152: v24.99,14.22 21.79,11.02 21.79,7.21 CONTROL.27 | v41.91,52.78 IC3.13
  Bottom 0.152: v24.99,14.22 28.04,14.22 40.69,26.87 IC1.13 40.69,27.03 38.71,29.01 38.71,40.89 41.91,44.09 v41.91,52.78
N$3
  Top 0.152: U$1.7 96.47,26.57 95.56,26.57 94.49,25.5 64.62,25.5 48.62,41.5 46.94,41.5 45.72,42.72 DISP1.11
  Bottom 0.152: IC1.21 46.94,36.63 46.94,41.5 45.72,42.72 DISP1.11
N$4
  Top 0.152: U$1.6 99.06,26.72 98.15,26.72 82.14,42.72 55.93,42.72 DISP1.7
  Bottom 0.152: IC1.22 48.16,36.47 47.7,36.02 47.7,35.86 47.4,35.56 46.48,35.56 46.33,35.71 46.33,37.85 41.91,42.27 41.91,43.18 43.28,44.55 54.1,44.55 55.78,42.88 DISP1.7
N$5
  Bottom 0.152: IC1.23 49.53,28.4 50.14,27.79 50.14,21.39 50.75,20.78 DISP1.4 50.9,20.63 52.58,18.95 83.06,18.95 95.56,6.45 96.47,6.45 U$1.4
N$6  (via drill 0.35)
  Top 0.152: v50.75,28.25 50.75,25.81 46.02,21.08 | 46.02,21.08 45.72,20.78 DISP1.2 46.02,21.08 | 46.02,21.08 47.85,19.25 77.72,19.25 90.53,6.45 91.44,6.45 U$1.2
  Bottom 0.152: v50.75,28.25 50.75,36.47 IC1.24
N$7
  Bottom 0.152: 46.79,24.13 43.28,20.63 DISP1.1 | 46.79,24.13 48.92,26.26 48.92,37.39 49.07,37.54 51.21,37.54 51.51,37.24 51.51,37.08 51.97,36.63 IC1.25 | 46.79,24.13 49.53,21.39 49.53,20.32 63.4,6.45 88.85,6.45 U$1.1
N$8
  Top 0.152: U$1.9 91.44,26.72 90.53,26.72 75.74,41.5 49.53,41.5 48.31,42.72 DISP1.10
  Bottom 0.152: IC1.26 53.34,37.69 48.31,42.72 DISP1.10
N$9  (via drill 0.35)
  Top 0.152: v54.56,34.65 54.56,22 53.34,20.78 DISP1.5
  Bottom 0.152: v54.56,34.65 54.56,36.47 IC1.27 | U$1.10 88.85,26.57 87.48,26.57 80.16,19.25 54.71,19.25 53.34,20.63 DISP1.5
N$10  (via drill 0.35)
  Top 0.152: v53.95,33.12 53.95,26.42 50.44,22.91 | 50.44,22.91 48.31,20.78 DISP1.3 | 50.44,22.91 51.97,21.39 51.97,20.32 52.73,19.56 85.04,19.56 98.15,6.45 99.06,6.45 U$1.5
  Bottom 0.152: v53.95,33.12 55.78,34.95 55.78,36.47 IC1.28
N$11
  Bottom 0.152: IC1.1 55.93,27.03 55.93,34.65 56.54,35.25 56.54,40.28 54.56,42.27 54.56,43.33 53.65,44.25 44.65,44.25 43.28,42.88 DISP1.12
N$12
  Bottom 0.152: IC1.2 54.56,26.87 53.95,26.26 53.95,26.11 53.8,25.96 52.88,25.96 52.73,26.11 52.73,37.24 48.46,41.5 47.7,41.5 47.09,42.11 47.09,43.33 47.7,43.94 49.68,43.94 50.75,42.88 DISP1.9
N$13
  Bottom 0.152: IC1.3 53.34,35.1 53.95,35.71 53.95,42.11 53.34,42.72 DISP1.8
N$14
  Bottom 0.152: IC1.4 52.12,26.87 52.12,24.43 55.78,20.78 DISP1.6
N$15
  Bottom 0.152: IC1.5 50.9,26.87 50.9,24.89 54.71,21.08 54.71,20.17 55.32,19.56 80.01,19.56 88.39,27.94 92.66,27.94 93.88,26.72 U$1.8
N$22
  Top 0.152: R1.2 15.7,58.42 15.7,59.94 16.46,60.71 D1.A
N$23
  Top 0.152: R2.2 22.1,58.42 22.1,59.94 22.86,60.71 D2.A
N$24
  Top 0.152: R3.2 28.5,58.42 28.5,60.1 29.11,60.71 D3.A
N$25
  Top 0.152: R4.2 34.75,58.42 34.75,59.94 35.51,60.71 D4.A
N$26
  Top 0.152: R5.2 41.15,58.42 41.15,59.94 41.91,60.71 D5.A
N$27
  Top 0.152: R7.2 53.8,58.42 53.8,59.94 54.56,60.71 D7.A
N$28
  Top 0.152: R8.2 60.2,58.42 60.2,59.94 60.96,60.71 D8.A
N$29
  Top 0.152: R9.2 66.6,58.42 66.6,60.1 67.21,60.71 D9.A
N$30
  Top 0.152: R10.2 72.85,58.42 72.85,59.94 73.61,60.71 D10.A
N$31
  Top 0.152: R11.2 79.25,58.42 79.25,59.94 80.01,60.71 D11.A
N$32
  Top 0.152: R12.2 85.65,58.42 85.65,60.1 86.26,60.71 D12.A
N$33
  Top 0.152: R6.2 47.55,58.42 47.55,60.1 48.16,60.71 D6.A
N$34
  Top 0.152: R1.1 19.96,58.42 30.18,48.21 46.18,48.21 48.31,46.08 IC3.21
N$35
  Top 0.152: R2.1 23.62,58.42 22.86,57.66 21.18,57.66 19.66,59.18 16.61,59.18 16.46,59.03 16.46,57.81 26.37,47.9 45.26,47.9 46.33,46.84 46.33,45.31 46.63,45.01 48.62,45.01 49.53,45.92 IC3.22
N$36
  Top 0.152: R3.1 33.22,58.42 43.13,48.51 48.46,48.51 50.9,46.08 IC3.23
N$37
  Top 0.152: R4.1 39.62,58.42 41.45,56.59 44.81,56.59 45.11,56.29 45.11,53.09 52.12,46.08 IC3.24
N$38
  Top 0.152: R5.1 44.35,58.42 46.33,56.44 46.33,53.54 51.36,48.51 51.51,48.51 53.34,46.69 IC3.25
N$39
  Top 0.152: R6.1 51.97,58.42 53.95,56.44 53.95,46.69 54.56,46.08 IC3.26
N$40  (via drill 0.35)
  Top 0.152: v55.47,56.9 55.47,58.42 R7.1 | v55.47,47.3 55.47,46.38 55.78,46.08 IC3.27
  Bottom 0.152: v55.47,47.3 v55.47,56.9
N$41
  Top 0.152: R8.1 61.72,58.42 61.72,50.65 57.15,46.08 IC3.28
N$42
  Top 0.152: IC3.1 57.15,58.57 60.2,61.62 68.12,61.62 68.28,61.47 68.28,58.42 R9.1
N$43
  Top 0.152: R10.1 74.37,58.42 73.61,57.66 64.01,57.66 62.48,59.18 61.11,59.18 60.96,59.03 60.96,57.81 57.76,54.61 56.69,54.61 55.78,55.52 IC3.2
N$44
  Top 0.152: R11.1 80.77,58.42 80.01,57.66 78.49,57.66 74.22,61.92 57.46,61.92 54.56,59.03 54.56,55.68 IC3.3
N$45
  Top 0.152: R12.1 87.17,58.42 86.41,57.66 84.73,57.66 80.16,62.23 51.51,62.23 48.31,59.03 48.31,57.81 49.53,56.59 52.43,56.59 53.34,55.68 IC3.4
N$57
  Top 0.152: CAN_SERIAL.1 5.03,29.46 2.59,29.46 1.37,28.25 1.37,25.04 4.88,21.54 13.56,21.54 15.39,19.71 CAN_INTERFACE.1
N$58
  Top 0.152: CAN_INTERFACE.4 15.39,23.52 11.12,23.52 10.36,24.28 2.59,24.28 1.68,25.2 1.68,28.09 2.13,28.55 5.49,28.55 6.4,29.46 CAN_SERIAL.2
OSC1  (via drill 0.35)
  Top 0.152: C2.2 2.59,18.64 4.57,18.64 6.25,20.32 Y1.2 | v9.75,24.89 13.87,29.01 13.87,29.46 CAN_SERIAL.8
  Bottom 0.152: v9.75,24.89 9.75,23.67 6.4,20.32 Y1.2
OSC2
  Top 0.152: C3.2 2.59,27.48 4.27,27.48 Y1.1 6.4,25.5 8.69,25.5 12.65,29.46 CAN_SERIAL.7
PARTY1
  Top 0.152: CONTROL.10 24.99,15.6 24.99,15.14 25.3,14.83 26.06,14.83 26.37,15.14 34.9,15.14 37.03,13 37.03,3.86 35.81,2.64 PARTY1.2
PARTY2  (via drill 0.35)
  Top 0.152: v24.08,14.22 24.08,15.6 CONTROL.11 | v27.58,4.32 29.26,2.64 PARTY2.2
  Bottom 0.152: v24.08,14.22 24.08,10.72 27.58,7.21 v27.58,4.32
RESET  (via drill 0.35)
  Top 0.152: v14.78,6.91 14.02,7.67 14.02,7.98 R21.2 | v22.4,8.43 23.16,7.67 23.16,7.21 CONTROL.29 | v6.4,30.68 6.4,39.06 CAN_SERIAL.17 | v25.3,5.54 27.28,5.54 29.26,7.52 35.51,7.52 PROGRAM.3
  Bottom 0.152: v6.4,30.68 6.4,29.16 14.78,20.78 v14.78,6.91 20.88,6.91 v22.4,8.43 v25.3,5.54
RPADDLE
  Top 0.152: CONTROL.25 20.12,7.06 20.12,6.6 23.01,3.71 23.62,3.71 26.06,1.27 47.09,1.27 48.31,2.49 RPADDLE.2
RX
  Top 0.152: CONTROL.30 24.08,7.21 24.08,12.39 26.52,14.83 33.38,14.83 35.51,12.7 PROGRAM.1
SCK
  Top 0.152: CAN_SERIAL.13 11.43,33.27 14.63,30.07 14.63,28.85 13.87,28.09 13.87,26.11 15.85,24.13 16.15,24.13 17.37,22.91 17.37,15.44 18.44,14.38 CONTROL.17
SS  (via drill 0.35)
  Top 0.152: v7.62,34.19 CAN_SERIAL.16 | v21.79,16.97 21.79,15.75 CONTROL.14
  Bottom 0.152: v7.62,34.19 21.79,20.01 v21.79,16.97
T/S-TOOGLE  (via drill 0.35)
  Top 0.152: v31.24,2.03 31.24,2.49 28.8,4.93 22.55,4.93 20.88,6.6 20.88,7.06 CONTROL.26
  Bottom 0.152: v31.24,2.03 31.55,2.03 32.31,1.27 40.84,1.27 42.06,2.49 T/S-TOOGLE.2
TX
  Top 0.152: PROGRAM.2 33.38,7.98 26.52,7.98 26.37,8.13 25.3,8.13 24.99,7.82 24.99,7.21 CONTROL.31
VCC  (via drill 0.35)
  Top 0.152: T/S-TOOGLE.1 39.32,2.64 40.39,2.64 41.45,3.71 44.35,3.71 45.41,2.64 RPADDLE.1 | CONTROL.4 27.13,11.18 26.52,11.18 26.21,11.48 26.21,12.24 26.52,12.55 27.13,12.55 CONTROL.6 27.28,12.55 33.98,12.55 35.2,11.33 36.12,11.33 36.73,10.72 36.73,6.45 32.92,2.64 PARTY1.1 | 17.98,13.31 14.48,9.8 14.02,9.8 R21.1 13.87,9.65 13.87,9.35 13.11,8.59 13.11,3.25 13.72,2.64 LPADDLE.1 | 17.98,13.31 18.44,13.31 CONTROL.18 17.98,13.31 | 17.98,13.31 17.07,14.22 17.07,21.08 16,22.15 15.55,22.15 CAN_INTERFACE.3 | R20.2 13.11,49.43 12.34,48.67 12.34,45.77 C1.1 12.19,45.62 8.99,42.42 8.99,39.98 | 13.26,39.98 13.26,41.35 POWER.1 | 13.26,39.98 13.26,38.46 15.85,35.86 15.85,26.72 C6.1 | 13.26,39.98 8.99,39.98 | 8.99,39.98 5.94,39.98 5.18,39.22 CAN_SERIAL.18 | 41.76,46.08 41.91,46.08 IC3.16 41.76,46.08 | 41.76,46.08 40.69,46.08 IC3.15 | 44.04,46.38 43.89,46.53 43.89,46.69 43.59,46.99 42.67,46.99 41.76,46.08 | 44.04,46.38 44.35,46.08 IC3.18 | v46.94,53.85 46.94,55.52 IC3.9 | v44.96,47.3 44.04,46.38
  Bottom 0.152: LPADDLE.1 13.87,2.64 15.09,2.64 16.15,3.71 19.05,3.71 20.12,2.64 LAUNCH.1 20.27,2.64 21.34,3.71 23.62,3.71 24.69,2.64 26.37,2.64 PARTY2.1 26.52,2.64 27.58,3.71 30.02,3.71 31.09,2.64 32.77,2.64 PARTY1.1 32.92,2.64 33.98,3.71 36.27,3.71 37.34,2.64 39.17,2.64 T/S-TOOGLE.1 39.32,2.64 39.32,20.47 45.72,26.87 IC1.9 45.72,32.97 43.28,35.41 43.28,36.47 IC1.18 43.13,36.63 43.13,37.24 41.6,38.76 41.6,43.33 45.26,46.99 | 46.94,53.39 46.94,48.67 45.26,46.99 | 46.94,53.39 v46.94,53.85 | 45.26,46.99 v44.96,47.3 | 46.94,53.39 41.6,53.39 30.18,41.96 12.8,41.96 POWER.1
(copper drawn outside any net)
  shapes: Top area x2